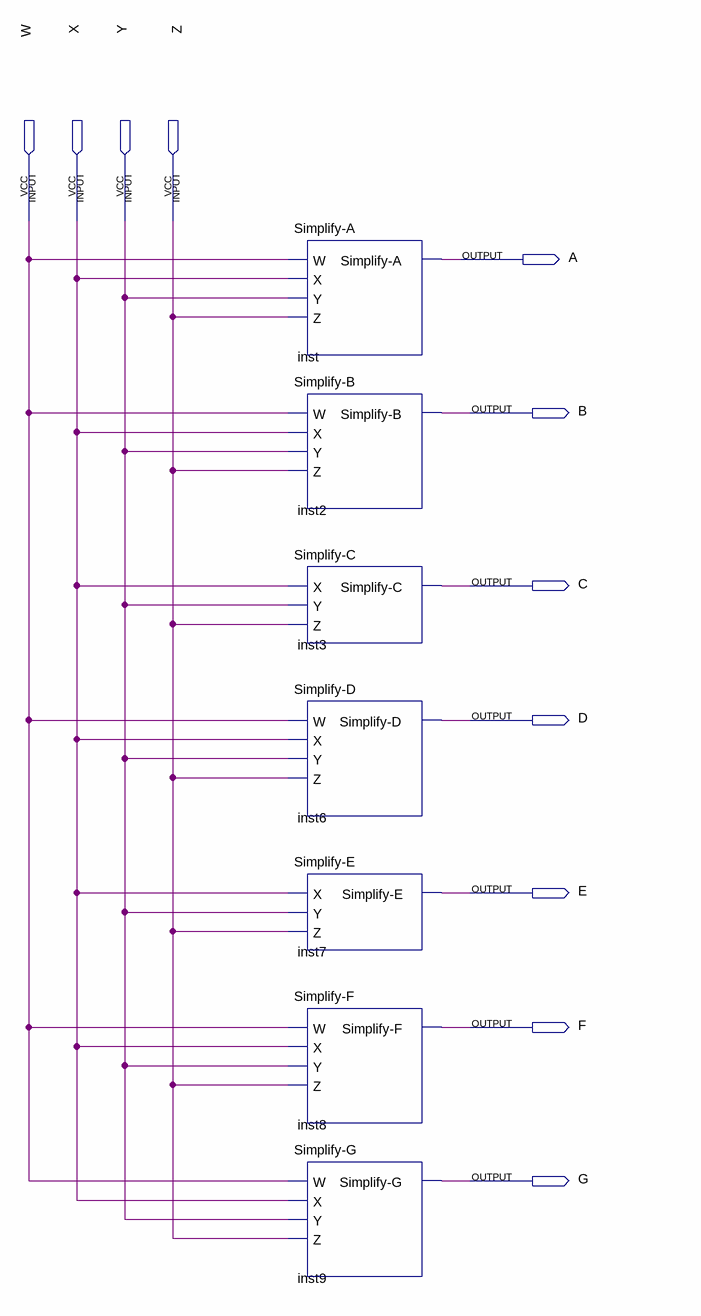
[diagram p0: schematic sheet]
// Quartus schematic BcdToSSD.bdf as structural Verilog: 7 symbols, 11 pins
module BcdToSSD (
  input  W,
  input  X,
  input  Y,
  input  Z,
  output A,
  output B,
  output C,
  output D,
  output E,
  output F,
  output G
);

  \Simplify-A  inst (.W(W), .X(X), .Y(Y), .Z(Z), .\Simplify-A (A));
  \Simplify-B  inst2 (.W(W), .X(X), .Y(Y), .Z(Z), .\Simplify-B (B));
  \Simplify-C  inst3 (.X(X), .Y(Y), .Z(Z), .\Simplify-C (C));
  \Simplify-D  inst6 (.W(W), .X(X), .Y(Y), .Z(Z), .\Simplify-D (D));
  \Simplify-E  inst7 (.X(X), .Y(Y), .Z(Z), .\Simplify-E (E));
  \Simplify-F  inst8 (.W(W), .X(X), .Y(Y), .Z(Z), .\Simplify-F (F));
  \Simplify-G  inst9 (.W(W), .X(X), .Y(Y), .Z(Z), .\Simplify-G (G));
endmodule
